# EAGLE design Pi2RMini v1.0 (EAGLE 6.1)
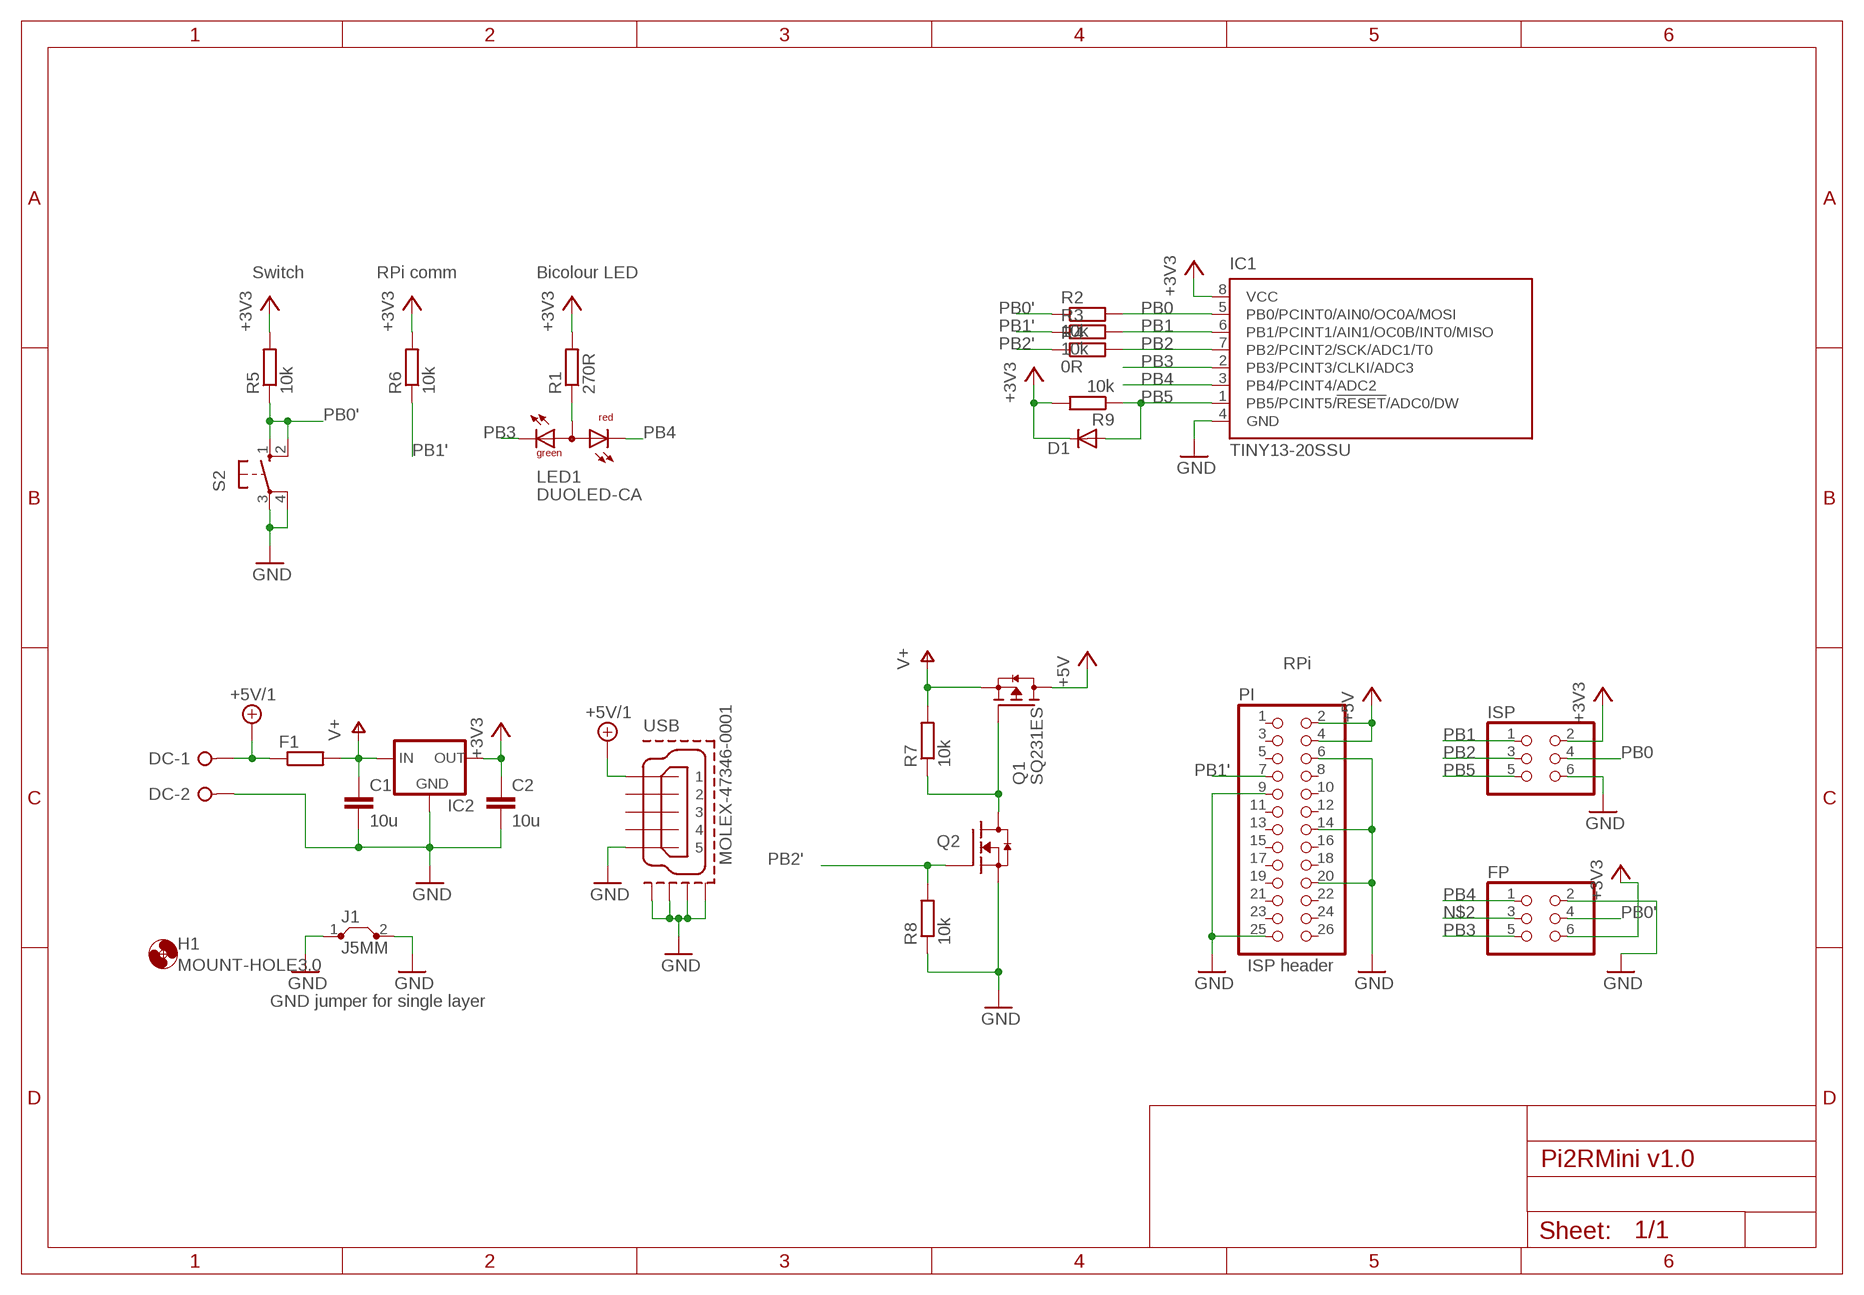
[diagram p0: schematic, sheet 1]

## Parts
C1  10u  C-EUC0805  [C0805]
C2  10u  C-EUC0805  [C0805]
D1  DIODE-MICROMELF-R  [MICROMELF-R]
DC  W237-02P  [W237-132]
F1  R-EU_R1210  [R1210]
FP  PINHD-2X3  [2X03]
H1  MOUNT-HOLE3.0  [3,0]
IC1  TINY13-20SSU  [8S1]
IC2  MCP1700TT  [SOT-23]
ISP  PINHD-2X3  [2X03]
J1  J5MM  [05]
LED1  DUOLED-CA  [SOT-23]
PI  PINHD-2X13  [2X13]
Q1  SQ231ES  [SOT-23]
Q2  2N7002  [SOT-23]
R1  270R  R-EU_R0805  [R0805]
R2  10k  R-EU_R0805  [R0805]
R3  10k  R-EU_R0805  [R0805]
R4  0R  R-EU_R0805  [R0805]
R5  10k  R-EU_R0805  [R0805]
R6  10k  R-EU_R0805  [R0805]
R7  10k  R-EU_R0805  [R0805]
R8  10k  R-EU_R0805  [R0805]
R9  10k  R-EU_R0805  [R0805]
S2  10-XX  [B3F-10XX]
USB  MOLEX-47346-0001  [MOLEX-47364-0001]

## Nets
+3V3: C2.1 D1.C FP.6 IC1.8(VCC) IC2.2(OUT) ISP.2 R1.2 R5.2 R6.2 R9.2
+5V: PI.2 PI.4 Q1.3(D)
+5V/1: DC.1 F1.1 USB.1
GND: C1.2 C2.2 DC.2 FP.2 IC1.4(GND) IC2.1(GND) ISP.6 J1.1 J1.2 PI.6 PI.9 PI.14 PI.20 PI.25 Q2.2(S) R8.1 S2.3(P) S2.4(P1) USB.5 USB.GND1 USB.GND2 USB.GND3 USB.GND4
N$2: FP.3 LED1.3(A) R1.1
N$12: Q1.1(G) Q2.3(D) R7.1
PB0: IC1.5(PB0/PCINT0/AIN0/OC0A/MOSI) ISP.4 R2.2
PB0': FP.4 R2.1 R5.1 S2.1(S) S2.2(S1)
PB1: IC1.6(PB1/PCINT1/AIN1/OC0B/INT0/MISO) ISP.1 R3.2
PB1': PI.7 R3.1 R6.1
PB2: IC1.7(PB2/PCINT2/SCK/ADC1/T0) ISP.3 R4.2
PB2': Q2.1(G) R4.1 R8.2
PB3: FP.5 IC1.2(PB3/PCINT3/CLKI/ADC3) LED1.2(CG)
PB4: FP.1 IC1.3(PB4/PCINT4/ADC2) LED1.1(CR)
PB5: D1.A IC1.1(PB5/PCINT5/!RESET!/ADC0/DW) ISP.5 R9.1
V+: C1.1 F1.2 IC2.3(IN) Q1.2(S) R7.2
Unconnected: PI.1 PI.3 PI.5 PI.8 PI.10 PI.11 PI.12 PI.13 PI.15 PI.16 PI.17 PI.18 PI.19 PI.21 PI.22 PI.23 PI.24 PI.26 USB.2 USB.3 USB.4

## Notes on the sheet
- Switch | RPi comm | Bicolour LED
- RPi
- ISP header
- GND jumper for single layer

## Library data of the parts
C1 C2 = rcl:C-EU: CAPACITOR, European symbol
D1 = diode:DIODE-: DIODE
DC = con-wago-508:W237-02P: WAGO SREW CLAMP; OC_FARNELL: unknown; OC_NEWARK: unknown
F1 R1-R9 = rcl:R-EU_: RESISTOR, European symbol
FP ISP = pinhead:PINHD-2X3: PIN HEADER
H1 = holes:MOUNT-HOLE: MOUNTING HOLE with drill center marker
IC1 = atmel:TINY13: 8-bit AVR Microcontroller with 1K Bytes In-System Programmable Flash Source: http://www.atmel.com/dyn/resources/prod_documents/2535S.pdf; MPN: ATTINY13-20SSU; OC_FARNELL: 1455133; OC_NEWARK: 58M3771
IC2 = AWJLEagleLib:MCP1700: Microchip MCP1700 positive regulator
J1 = jumper:J: Bridge
LED1 = AWJLEagleLib:DUOLED-CA: Red/green multicolour LED
PI = pinhead:PINHD-2X13: PIN HEADER
Q1 = AWJLEagleLib:SQ231ES: Vishay Siliconix SQ2315ES P-channel MOSFET
Q2 = AWJLEagleLib:2N7002: 300 mA N-channel MOSFET
S2 = switch-omron:10-XX: OMRON SWITCH; MPN: B3F-1000; OC_FARNELL: 176432; OC_NEWARK: 36M3542
USB = usb_con-update:MOLEX-47346-0001: MICRO USB B, BOTTOM MOUNT

## Board
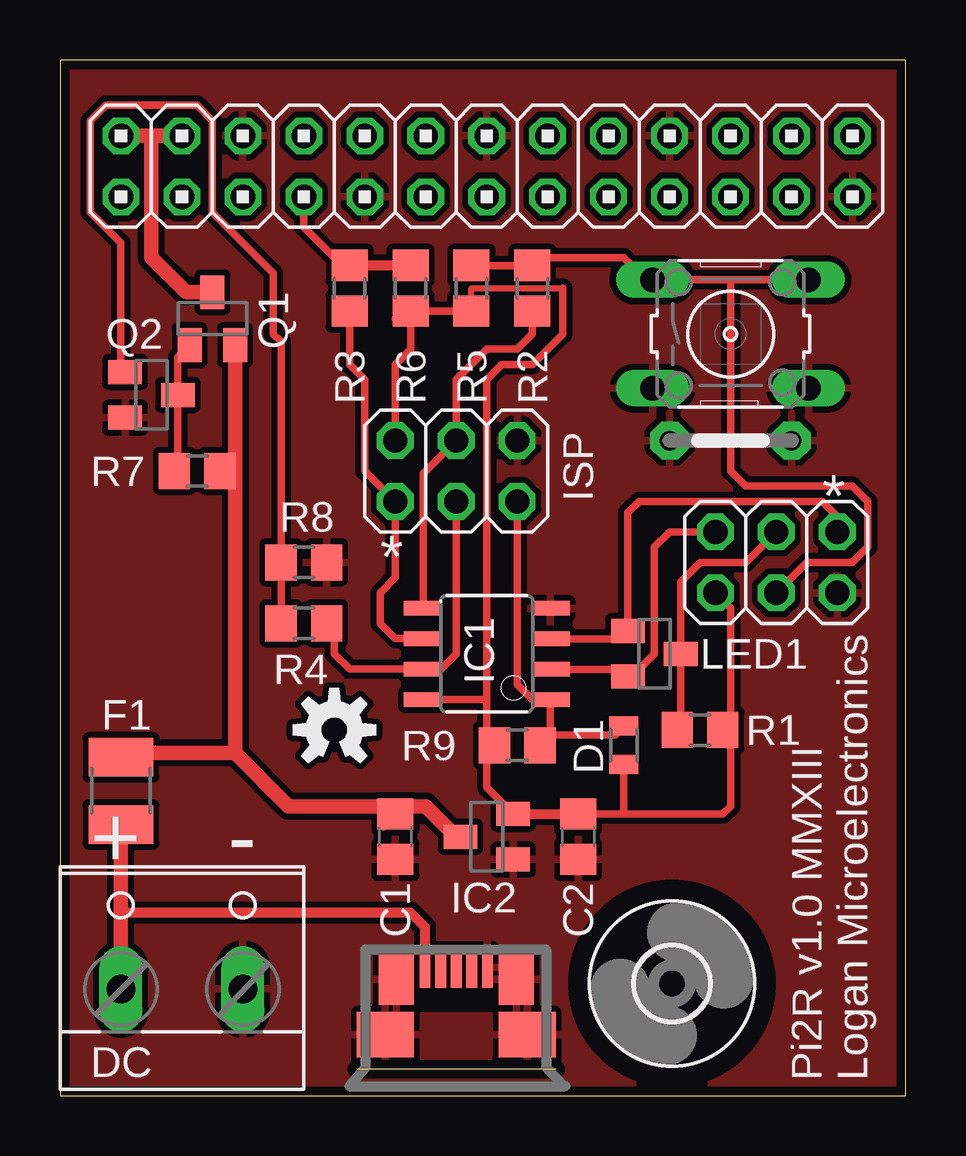
[diagram p1: board, top side]
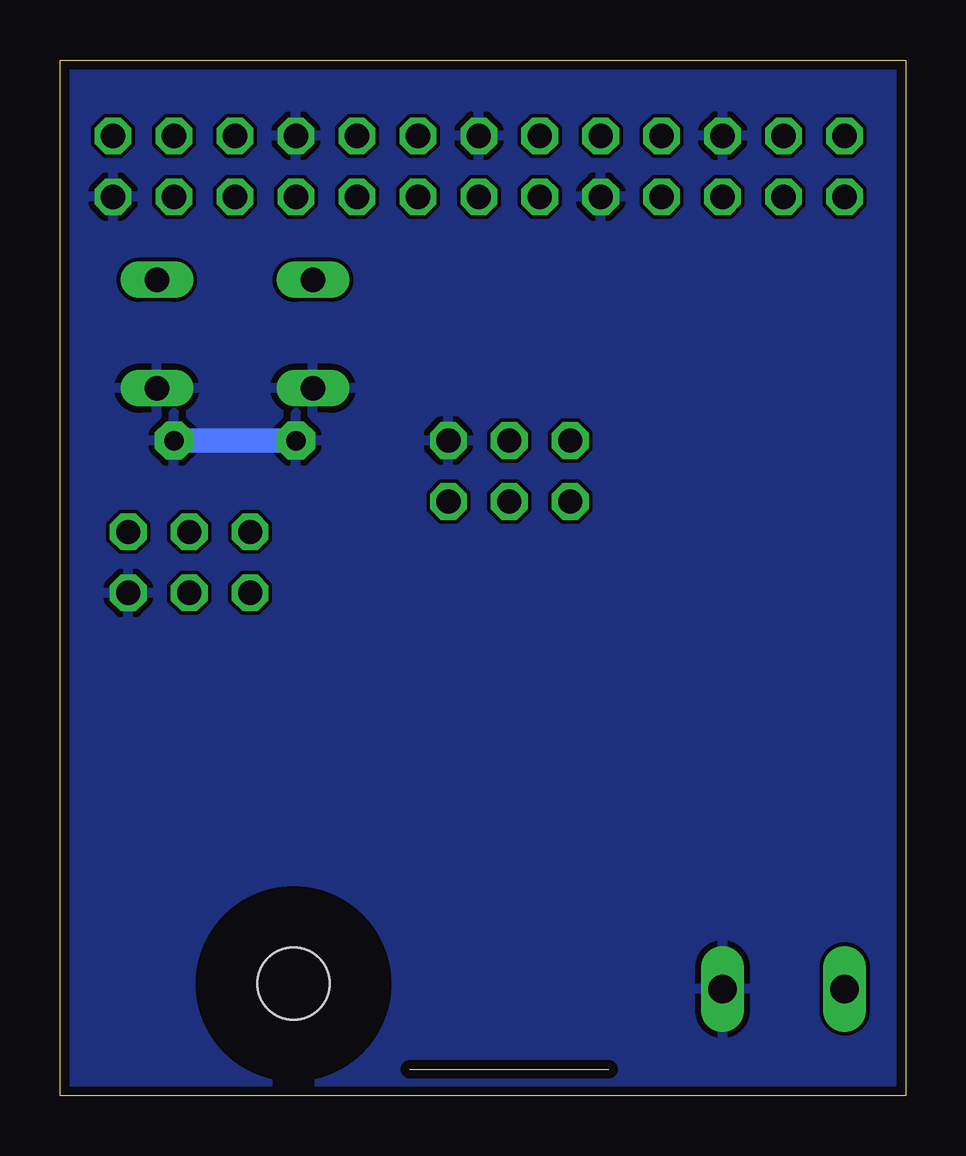
[diagram p2: board, bottom side, seen from below]

Size 35.23 x 43.17 mm. Coordinates in mm from the lower left corner, seen from the top.
Outline: 0,0 35.23,0 35.23,43.17 0,43.17 0,0
Copper layers (1*16): Top 0.0356mm / dielectric 1.5011mm / Bottom 0.0356mm
Design rules: minimum track width 6mil, minimum drill 13mil, track to track 6mil, track to pad 6mil, pad to pad 6mil, via to via 6mil, smd to smd 6mil, copper to edge 15mil, drill to drill 6mil, minimum pad ring 7mil, minimum via ring 7mil, stop-mask expansion 4mil, vias tented up to drill 0mil, thermal gap 10mil

### Footprints (pad centres in the part's own frame; a part is rotated, then mirrored left to right if it is on the bottom)
C0805 = smd 1.3 x 1.5: 1 -0.95,0; 2 0.95,0
MICROMELF-R = smd 0.8 x 1.2: A 0.8,0; C -0.8,0
W237-132 = drill 1.194 long: 1 -2.54,-0.635; 2 2.54,-0.635
R1210 = smd 1.6 x 2.7: 1 -1.4,0; 2 1.4,0
2X03 = drill 1.016 octagon: 1 -2.54,-1.27; 2 -2.54,1.27; 3 0,-1.27; 4 0,1.27; 5 2.54,-1.27; 6 2.54,1.27
3,0 = hole 3: 0,0
8S1 = smd 0.6 x 1.6: 1 -1.905,-2.654; 2 -0.645,-2.654; 3 0.625,-2.654; 4 1.895,-2.654; 5 1.905,2.654; 6 0.635,2.654; 7 -0.635,2.654; 8 -1.905,2.654
SOT-23 = smd 1 x 1.4: 1 -0.95,-1.1; 2 0.95,-1.1; 3 0,1.1
05 = drill 0.813 pad 1.6 octagon: 1 -2.54,0; 2 2.54,0
2X13 = drill 1.016 octagon: 1 -15.24,-1.27; 2 -15.24,1.27; 3 -12.7,-1.27; 4 -12.7,1.27; 5 -10.16,-1.27; 6 -10.16,1.27; 7 -7.62,-1.27; 8 -7.62,1.27; 9 -5.08,-1.27; 10 -5.08,1.27; 11 -2.54,-1.27; 12 -2.54,1.27; 13 0,-1.27; 14 0,1.27; 15 2.54,-1.27; 16 2.54,1.27; 17 5.08,-1.27; 18 5.08,1.27; 19 7.62,-1.27; 20 7.62,1.27; 21 10.16,-1.27; 22 10.16,1.27; 23 12.7,-1.27; 24 12.7,1.27; 25 15.24,-1.27; 26 15.24,1.27
R0805 = smd 1.3 x 1.5: 1 -0.95,0; 2 0.95,0
B3F-10XX = drill 1.016 long: 1 -3.251,2.261; 2 3.251,2.261; 3 -3.251,-2.261; 4 3.251,-2.261
MOLEX-47364-0001 = smd 1.7 x 0.45: 1 2.8,1.3; 2 2.8,0.65; 3 2.8,0; 4 2.8,-0.65; 5 2.8,-1.3 | smd 1.9 x 2.375: GND1 0,2.95; GND4 0,-2.95 | smd 2.1 x 1.475: GND2 2.3,2.5; GND3 2.3,-2.5

### Placement (x,y rotation side)
C1  13.97,10.79 270 top
C2  21.59,10.79 270 top
D1  23.5,14.61 90 top
DC  5.08,5.08 0 top
F1  2.54,12.7 90 top
FP  29.84,22.23 180 top
H1  25.5,4.67 0 top
IC1  17.78,18.41 90 top
IC2  17.78,10.79 90 top
ISP  16.51,26.04 0 top
J1  27.94,27.3 0 top
LED1  24.77,18.41 270 top
PI  17.78,38.73 0 top
Q1  6.35,32.38 0 top
Q2  3.81,29.21 270 top
R1  26.67,15.24 0 top
R2  19.68,33.66 270 top
R3  12.06,33.66 270 top
R4  10k  [R0805]  10.16,19.68 0 top
R5  17.14,33.66 270 top
R6  14.61,33.66 270 top
R7  5.71,26.04 0 top
R8  10.16,22.23 180 top
R9  19.05,14.61 180 top
S2  27.94,31.75 0 top
USB  16.51,2.54 90 top

### Tracks (layer width: path | path; a pad name or v marks a point on that pad's centre or on a via)
+3V3
  Top 0.254: R5.2 17.14,33.66 20.95,33.66
  Top 0.305: IC1.8 17.78,16.51 | 17.78,16.51 17.78,14.61 | 17.78,14.61 17.78,12.85 IC2.2 | R6.2 13.97,32.38 | 20.95,33.66 20.95,31.75 19.68,30.48 18.41,30.48 17.78,29.84 17.78,16.51 | C2.1 23.5,11.74 | 23.5,11.74 27.62,11.74 27.94,12.06 27.94,15.24 | 27.94,15.24 27.94,20.32 FP.6 | ISP.2 13.97,30.48 14.61,31.11 R6.2 | R6.2 R5.2 | D1.C 23.5,11.74 | R1.2 27.94,15.24 | R9.2 17.78,14.61
  Top 0.406: IC2.2 C2.1
+5V
  Top 0.61: PI.4 3.81,40.01 | 3.81,40.01 PI.2 | Q1.3 5.25,33.48 3.81,34.92 3.81,40.01
+5V/1
  Top 0.406: USB.1 15.21,7.01 14.61,7.62 2.54,7.62
  Top 0.61: DC.1 2.54,7.62 F1.1
GND
  Bottom 1.016: J1.1 J1.2
  pour Top (isolate 0.254): 0,43.18 35.56,43.18 35.56,0 0,0
  pour Bottom: 0,43.18 35.56,43.18 35.56,0 0,0
N$1
  Top 0.01: 0.08,0.34 0.06,0.5
N$2
  Top 0.305: FP.3 28.57,22.23 26.67,22.23 25.86,21.42 LED1.3 25.86,15.38 R1.1
N$3
  Top 0.01: 11.89,14.13 arc10 12.07,14.22 12.51,13.86 12.81,14.16 12.45,14.6 arc19 12.6,14.97 13.17,15.03 13.17,15.45 12.6,15.51 arc19 12.45,15.88 12.81,16.32 12.51,16.62 12.07,16.26 arc19 11.7,16.41 11.64,16.98 11.22,16.98 11.16,16.41 arc19 10.79,16.26 10.35,16.62 10.05,16.32 10.41,15.88 arc19 10.26,15.51 9.69,15.45 9.69,15.03 10.26,14.97 arc19 10.41,14.6 10.05,14.16 10.35,13.86 10.79,14.22 arc10 10.97,14.13 11.22,14.73 arc-67 10.88,15.24 arc-247 11.64,14.73 11.89,14.13
N$12
  Top 0.305: 5.23,31.11 Q1.1 4.91,30.8 Q2.3 4.91,26.18 R7.1
PB0
  Top 0.305: IC1.5 15.13,25.92 ISP.4 16.51,29.84 17.78,31.11 19.05,31.11 19.68,31.75 R2.2
PB0'
  Top 0.305: R2.1 R5.1 | 19.92,34.37 R2.1 | FP.4 31.11,22.23 33.02,22.23 33.66,22.86 33.66,24.77 33.02,25.4 28.57,25.4 27.94,26.04 27.94,34.01 | R2.1 20,34.92 23.5,34.92 24.41,34.01 S2.1 27.94,34.01 | 27.94,34.01 S2.2
PB1
  Top 0.305: IC1.6 13.97,19.05 13.34,19.68 13.34,20.95 13.97,21.59 ISP.1 12.7,26.04 12.7,29.84 12.06,30.48 R3.2
PB1'
  Top 0.305: 11.75,34.6 10.16,36.2 PI.7 | R6.1 R3.1
  Top 0.406: R6.1 11.75,34.6
PB2
  Top 0.254: 15.88,17.78 IC1.7
  Top 0.305: IC1.7 12.06,17.78 11.43,18.41 11.43,19.36 R4.2 | ISP.3 16.51,18.41 15.88,17.78
PB2'
  Top 0.305: R4.1 R8.2 9.21,31.43 8.89,31.75 8.89,34.29 6.35,36.83 6.35,40.64 5.71,41.27 1.91,41.27 1.27,40.64 1.27,36.83 2.54,35.56 2.54,30.33 Q2.1
PB3
  Top 0.305: IC1.2 23.36,17.77 LED1.2 23.82,17.46 24.77,18.41 24.77,22.86 25.4,23.5 FP.5
PB4
  Top 0.305: IC1.3 23.34,19.04 LED1.1 23.66,24.3 24.13,24.77 31.75,24.77 32.38,24.13 FP.1
PB5
  Top 0.305: ISP.5 19.05,17.14 19.68,16.51 IC1.1 20.43,15.04 | 20.43,15.04 R9.1 | 20.43,15.04 23.13,15.04 D1.A
V+
  Top 0.305: R7.2 7.3,26.04
  Top 0.406: 13.48,11.26 C1.1
  Top 0.61: Q1.2 7.3,26.04 7.3,14.29 | IC2.3 16.51,10.79 15.24,12.06 14.29,12.06 | 14.29,12.06 C1.1 | 14.29,12.06 9.52,12.06 7.3,14.29 | 7.3,14.29 2.54,14.29 F1.2

### Text on the board
tPlace: * | * | + | - | Pi2R v1.0 MMXIII | Logan Microelectronics